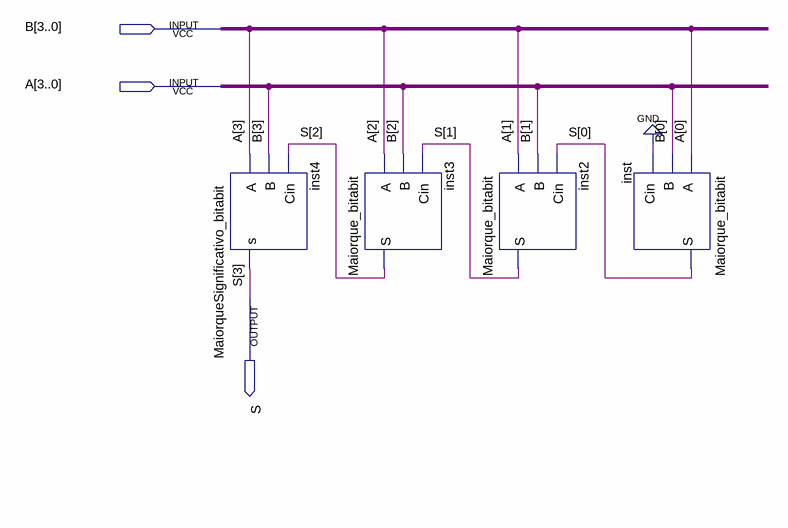
[diagram p0: schematic sheet]
// Quartus schematic Menorque4bits.bdf as structural Verilog: 4 symbols, 3 pins
module Menorque4bits (
  input  [3:0] B,
  input  [3:0] A,
  output S
);

  wire [2:0] S_bus;

  MaiorqueSignificativo_bitabit inst4 (.A(A[3]), .B(B[3]), .Cin(S_bus[2]), .s(S));
  Maiorque_bitabit inst3 (.A(A[2]), .B(B[2]), .Cin(S_bus[1]), .S(S_bus[2]));
  Maiorque_bitabit inst2 (.A(A[1]), .B(B[1]), .Cin(S_bus[0]), .S(S_bus[1]));
  Maiorque_bitabit inst (.A(A[0]), .B(B[0]), .Cin(1'b0), .S(S_bus[0]));

  // Other names for the same wires on the sheet: S[3] = S
endmodule
